# EAGLE design 暴走対策機能付き非常停止スイッチ (EAGLE 9.6.2)
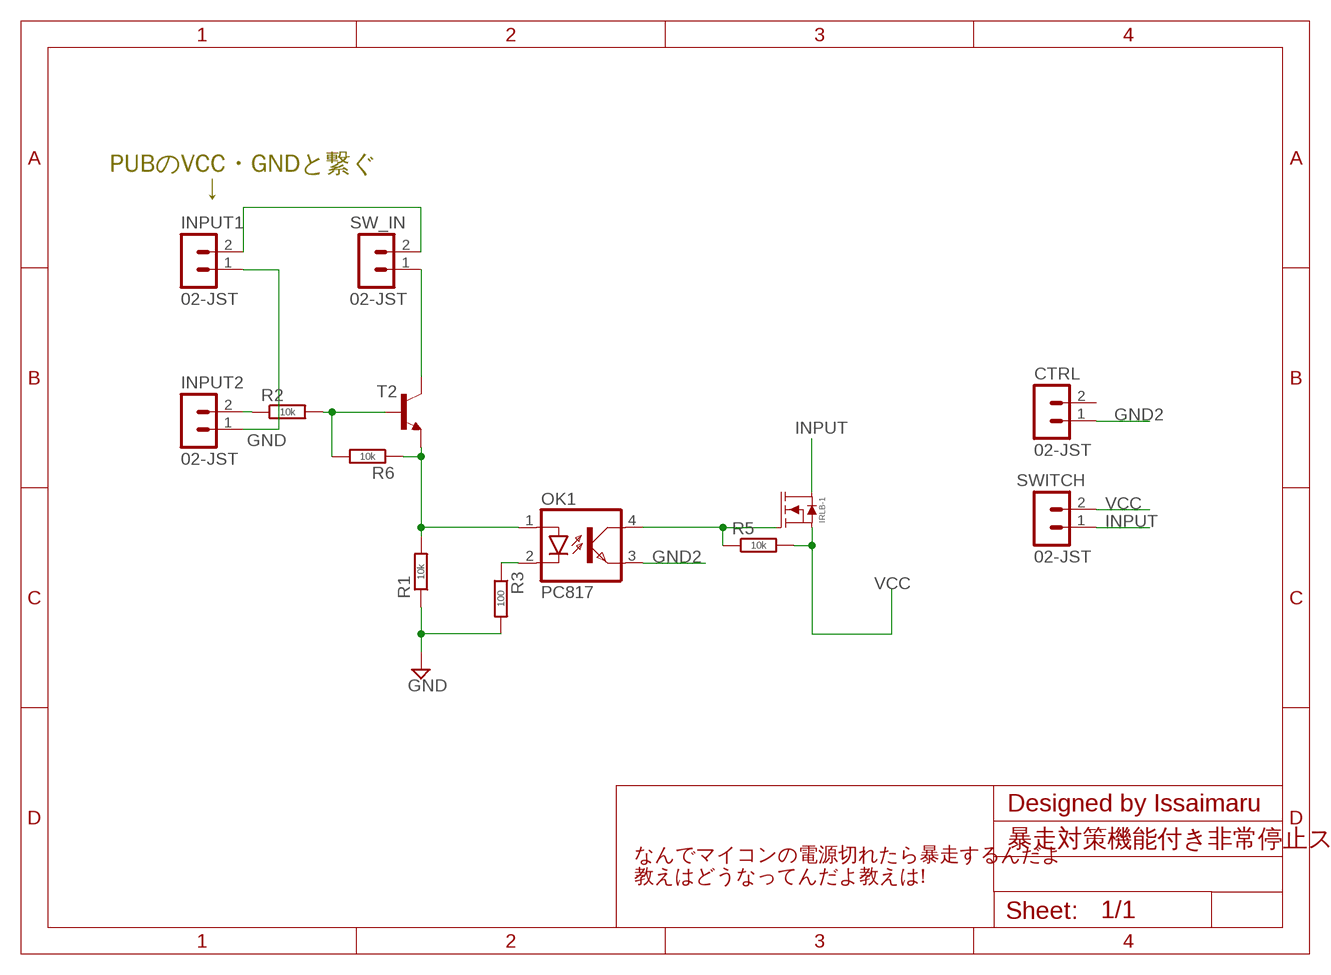
[diagram p0: schematic, sheet 1]

## Parts
CTRL  02-JST  [B2B-XH]
INPUT1  02-JST  [B2B-XH]
INPUT2  02-JST  [B2B-XH]
IRLB-1  IRLB3813STAND  [TO-220AB-STAND]
OK1  PC817  [DIL04]
R1  10k  R-EU_0204/7  [0204/7]
R2  10k  R-EU_0204/7  [0204/7]
R3  100  R-EU_0204/7  [0204/7]
R5  10k  R-EU_0204/7  [0204/7]
R6  10k  R-EU_0204/7  [0204/7]
SW_IN  02-JST  [B2B-XH]
SWITCH  02-JST  [B2B-XH]
T2  一般的なトランジスタ  [TO92-CEB]

## Nets
GND: INPUT1.1 INPUT2.1 R1.1 R3.2
GND2: CTRL.1 OK1.3(EMIT)
INPUT: IRLB-1.D SWITCH.1
N$1: SW_IN.1 T2.C
N$2: INPUT1.2 SW_IN.2
N$3: OK1.1(A) R1.2 R6.1 T2.E
N$4: INPUT2.2 R2.1
N$5: R2.2 R6.2 T2.B
N$6: OK1.2(C) R3.1
N$8: IRLB-1.G OK1.4(COL) R5.1
VCC: IRLB-1.S R5.2 SWITCH.2
Unconnected: CTRL.2

## Notes on the sheet
- PUBのVCC・GNDと繋ぐ
              ↓
- Designed by Issaimaru
- なんでマイコンの電源切れたら暴走するんだよ
  教えはどうなってんだよ教えは!

## Library data of the parts
CTRL INPUT1 INPUT2 SW_IN SWITCH = con-jst-xh:02-JST: JST CONNECTOR
IRLB-1 = OKUDA_libraries:IRLB3813
OK1 = optocoupler:PC817: SHARP OPTO COUPLER; MPN: PC817X4J000F; OC_FARNELL: 9707727; OC_NEWARK: 97K7059
R1-R3 R5 R6 = rcl:R-EU_: RESISTOR, European symbol; SPICEPREFIX: R
T2 = 一般的なトランジスタ:一般的なトランジスタ

## Board
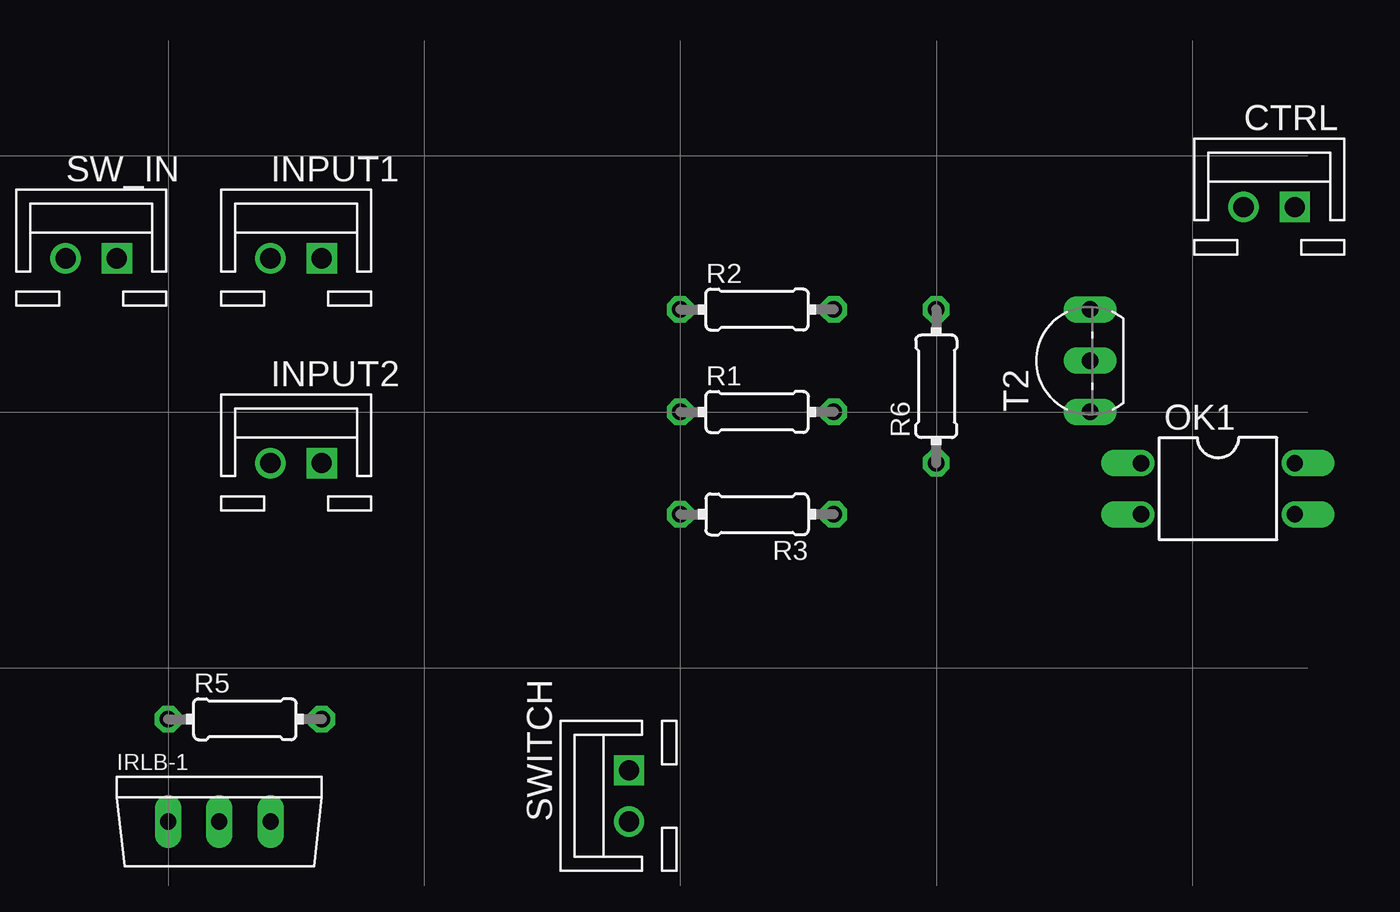
[diagram p1: board, top side]
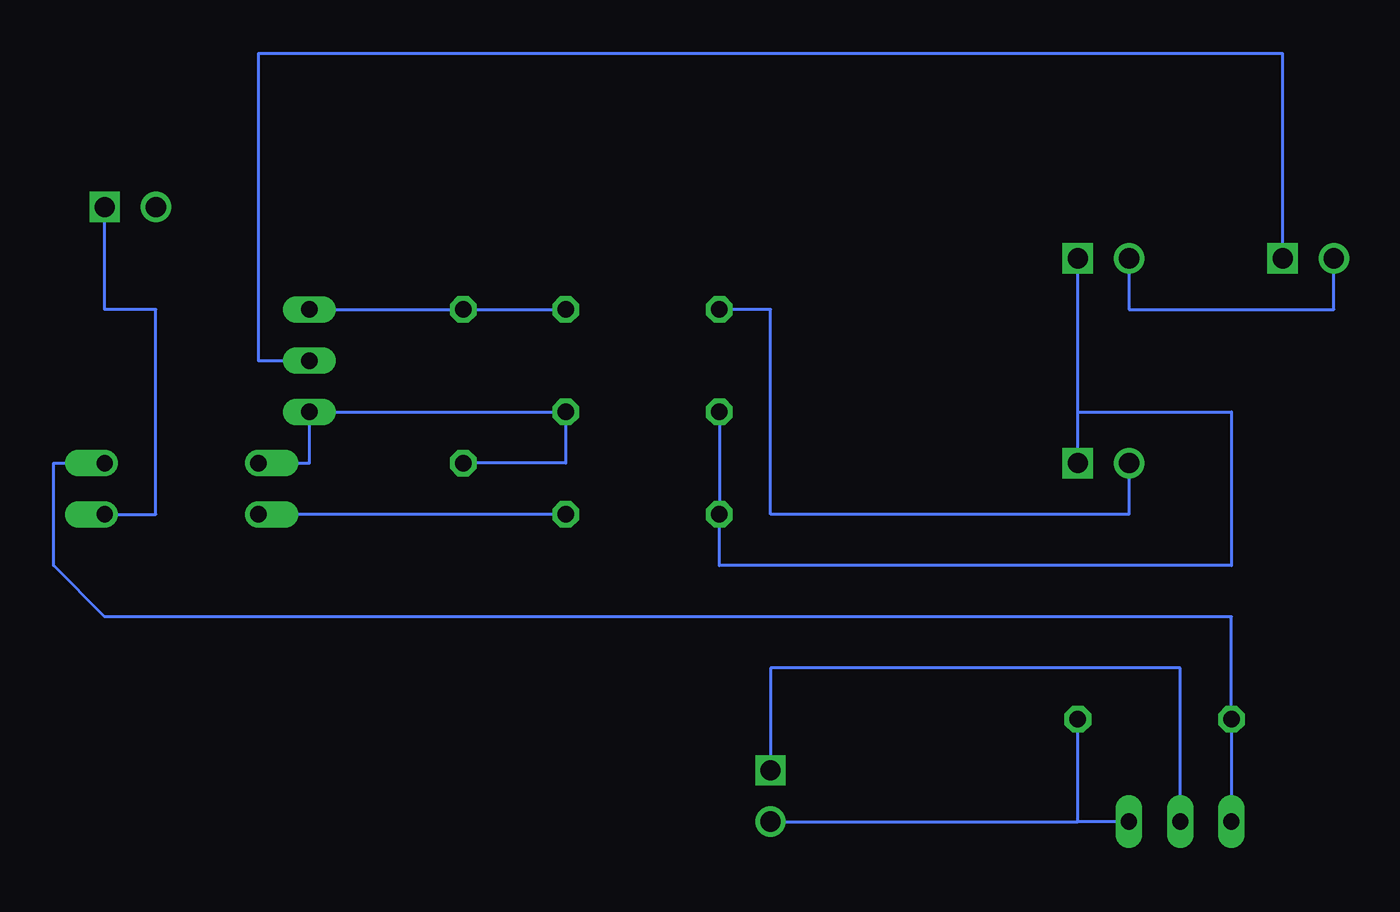
[diagram p2: board, bottom side, seen from below]

No outline drawn. Coordinates in mm, seen from the top.
Copper layers (1*16): Top 0.035mm / dielectric 1.5mm / Bottom 0.035mm
Design rules "default": minimum track width 6mil, minimum drill 0.35mm, track to track 6mil, track to pad 6mil, pad to pad 6mil, via to via 6mil, smd to smd 6mil, copper to edge 40mil, drill to drill 6mil, minimum pad ring 10mil, minimum via ring 8mil, stop-mask expansion 4mil, vias tented up to drill 0mil, thermal gap 10mil

### Footprints (pad centres in the part's own frame; a part is rotated, then mirrored left to right if it is on the bottom)
B2B-XH = drill 1 square: 1 1.27,0 | drill 1: 2 -1.27,0
TO-220AB-STAND = drill 0.8 long: D 0,0; G -2.54,0; S 2.54,0
DIL04 = drill 0.813 offset: 1 -1.27,-3.81; 2 1.27,-3.81; 3 1.27,3.81; 4 -1.27,3.81
0204/7 = drill 0.813 octagon: 1 -3.81,0; 2 3.81,0
TO92-CEB = drill 0.813 long: B 2.54,0; C 0,0; E -2.54,0

### Placement (x,y rotation side)
CTRL  67.31,35.56 0 top
INPUT1  19.05,33.02 0 top
INPUT2  19.05,22.86 0 top
IRLB-1  15.24,5.08 0 top
OK1  64.77,21.59 270 top
R1  41.91,25.4 0 top
R2  41.91,30.48 0 top
R3  41.91,20.32 180 top
R5  16.51,10.16 0 top
R6  50.8,26.67 90 top
SW_IN  8.89,33.02 0 top
SWITCH  35.56,6.35 90 top
T2  58.42,27.94 90 top
U$1  [TYPE.C]  0,0 0 top

### Tracks (layer width: path | path; a pad name or v marks a point on that pad's centre or on a via)
GND
  Bottom 0.152: INPUT2.1 20.32,25.4 | 20.32,25.4 INPUT1.1 | R1.1 R3.2 38.1,17.78 12.7,17.78 12.7,25.4 20.32,25.4
GND2
  Bottom 0.152: OK1.3 66.04,20.32 66.04,30.48 68.58,30.48 CTRL.1
INPUT
  Bottom 0.152: IRLB-1.D 15.24,12.7 35.56,12.7 SWITCH.1
N$1
  Bottom 0.152: SW_IN.1 10.16,43.18 60.96,43.18 60.96,27.94 T2.C
N$2
  Bottom 0.152: INPUT1.2 17.78,30.48 7.62,30.48 SW_IN.2
N$3
  Bottom 0.152: OK1.1 58.42,22.86 T2.E R1.2 45.72,22.86 R6.1
N$4
  Bottom 0.152: INPUT2.2 17.78,20.32 35.56,20.32 35.56,30.48 R2.1
N$5
  Bottom 0.152: T2.B R2.2 R6.2
N$6
  Bottom 0.152: R3.1 OK1.2
N$8
  Bottom 0.152: IRLB-1.G R5.1 12.7,15.24 68.58,15.24 71.12,17.78 71.12,22.86 OK1.4
VCC
  Bottom 0.152: IRLB-1.S 20.32,5.08 | 20.32,5.08 R5.2 | SWITCH.2 20.32,5.08